# Altium schematic sheet 16.USB_HUB_GL3510.SchDoc
size A3; CheckedBy: YPC; DocumentNumber: 16; Revision: V1.00; SheetNumber: 16; SheetTotal: 18; SheetName: USB_HUB_GL3510; SheetDescribe: USB3.1 Gen1 Hub Controller 原理子图; Designer: JOW; DesignDate: 2025-04-25; CheckedData: 2025-04-25; Rule: PcbType=ProtelPcb
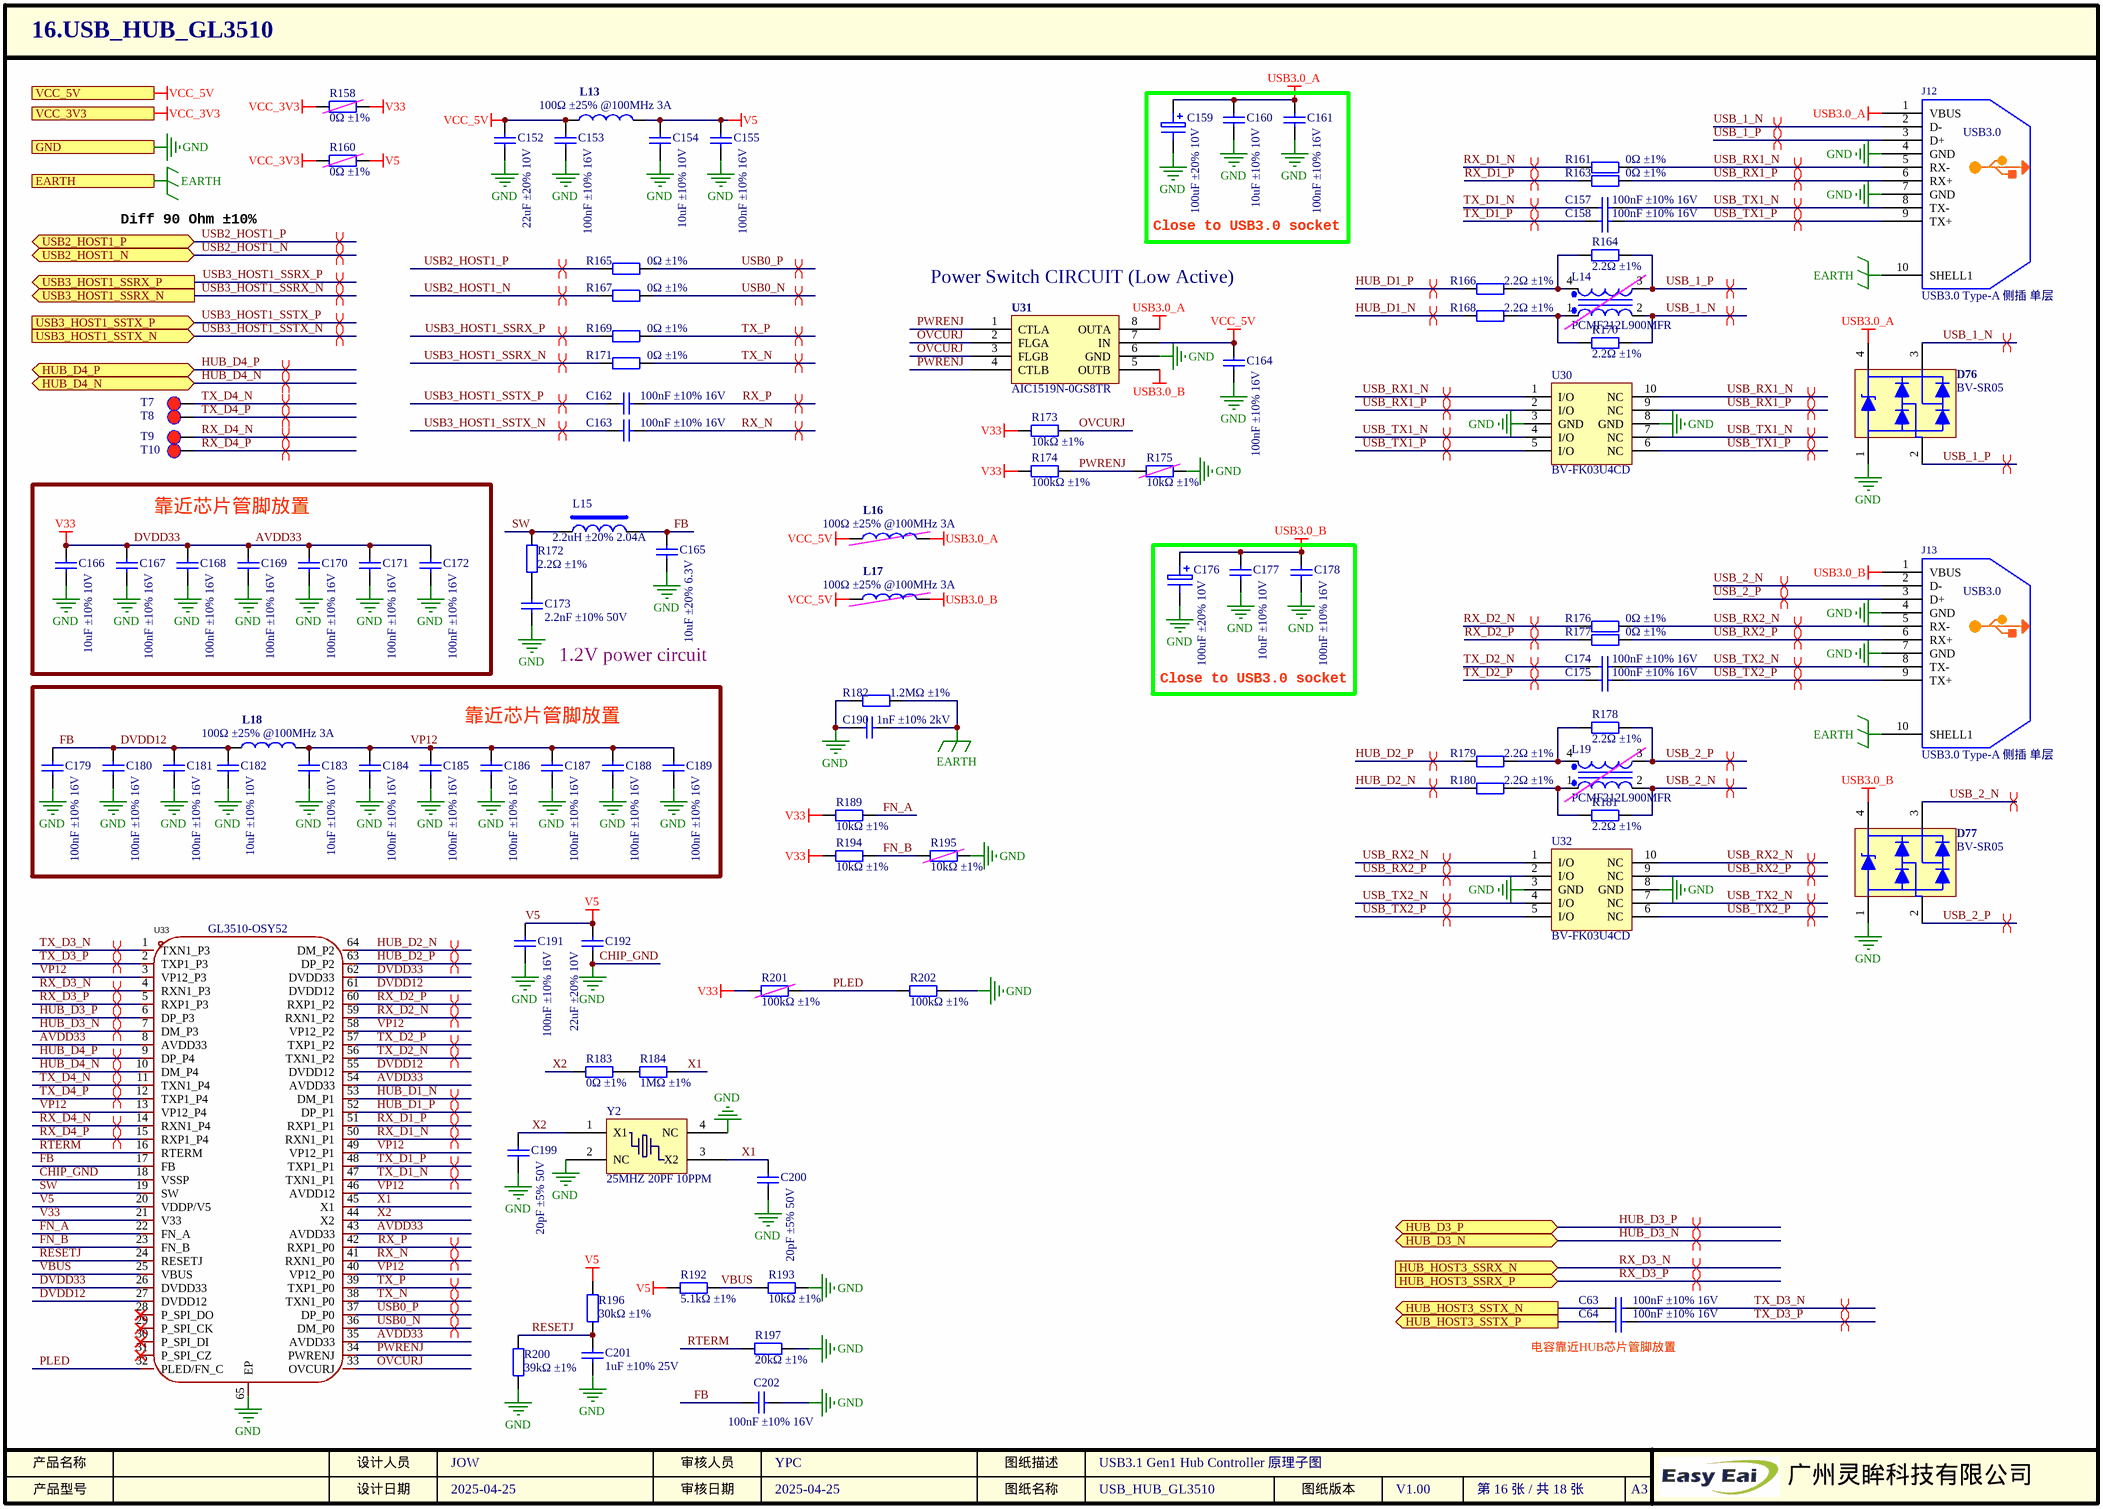
[diagram p0: 16.USB_HUB_GL3510.SchDoc]

## Parts
C63  描述: 100nF ±10% 16V  [0402_C]  (hidden comment: CL05B104KO5NNNC)
C64  描述: 100nF ±10% 16V  [0402_C]  (hidden comment: CL05B104KO5NNNC)
C152  描述: 22uF ±20% 10V  [0603_C]  (hidden comment: CL10A226MP8NUNE)
C153  描述: 100nF ±10% 16V  [0402_C]  (hidden comment: CL05B104KO5NNNC)
C154  描述: 10uF ±10% 10V  [0603_C]  (hidden comment: CL10A106KP8NNNC)
C155  描述: 100nF ±10% 16V  [0402_C]  (hidden comment: CL05B104KO5NNNC)
C157  描述: 100nF ±10% 16V  [0402_C]  (hidden comment: CL05B104KO5NNNC)
C158  描述: 100nF ±10% 16V  [0402_C]  (hidden comment: CL05B104KO5NNNC)
C159  描述: 100uF ±20% 10V  [SMD,D5xL5.4mm]  (hidden comment: RVT1A101M0505)
C160  描述: 10uF ±10% 10V  [0603_C]  (hidden comment: CL10A106KP8NNNC)
C161  描述: 100nF ±10% 16V  [0402_C]  (hidden comment: CL05B104KO5NNNC)
C162  描述: 100nF ±10% 16V  [0402_C]  (hidden comment: CL05B104KO5NNNC)
C163  描述: 100nF ±10% 16V  [0402_C]  (hidden comment: CL05B104KO5NNNC)
C164  描述: 100nF ±10% 16V  [0402_C]  (hidden comment: CL05B104KO5NNNC)
C165  描述: 10uF ±20% 6.3V  [0402_C]  (hidden comment: CL05A106MQ5NUNC)
C166  描述: 10uF ±10% 10V  [0603_C]  (hidden comment: CL10A106KP8NNNC)
C167  描述: 100nF ±10% 16V  [0402_C]  (hidden comment: CL05B104KO5NNNC)
C168  描述: 100nF ±10% 16V  [0402_C]  (hidden comment: CL05B104KO5NNNC)
C169  描述: 100nF ±10% 16V  [0402_C]  (hidden comment: CL05B104KO5NNNC)
C170  描述: 100nF ±10% 16V  [0402_C]  (hidden comment: CL05B104KO5NNNC)
C171  描述: 100nF ±10% 16V  [0402_C]  (hidden comment: CL05B104KO5NNNC)
C172  描述: 100nF ±10% 16V  [0402_C]  (hidden comment: CL05B104KO5NNNC)
C173  描述: 2.2nF ±10% 50V  [0402_C]  (hidden comment: 0402B222K500NT)
C174  描述: 100nF ±10% 16V  [0402_C]  (hidden comment: CL05B104KO5NNNC)
C175  描述: 100nF ±10% 16V  [0402_C]  (hidden comment: CL05B104KO5NNNC)
C176  描述: 100uF ±20% 10V  [SMD,D5xL5.4mm]  (hidden comment: RVT1A101M0505)
C177  描述: 10uF ±10% 10V  [0603_C]  (hidden comment: CL10A106KP8NNNC)
C178  描述: 100nF ±10% 16V  [0402_C]  (hidden comment: CL05B104KO5NNNC)
C179  描述: 100nF ±10% 16V  [0402_C]  (hidden comment: CL05B104KO5NNNC)
C180  描述: 100nF ±10% 16V  [0402_C]  (hidden comment: CL05B104KO5NNNC)
C181  描述: 100nF ±10% 16V  [0402_C]  (hidden comment: CL05B104KO5NNNC)
C182  描述: 10uF ±10% 10V  [0603_C]  (hidden comment: CL10A106KP8NNNC)
C183  描述: 10uF ±10% 10V  [0603_C]  (hidden comment: CL10A106KP8NNNC)
C184  描述: 100nF ±10% 16V  [0402_C]  (hidden comment: CL05B104KO5NNNC)
C185  描述: 100nF ±10% 16V  [0402_C]  (hidden comment: CL05B104KO5NNNC)
C186  描述: 100nF ±10% 16V  [0402_C]  (hidden comment: CL05B104KO5NNNC)
C187  描述: 100nF ±10% 16V  [0402_C]  (hidden comment: CL05B104KO5NNNC)
C188  描述: 100nF ±10% 16V  [0402_C]  (hidden comment: CL05B104KO5NNNC)
C189  描述: 100nF ±10% 16V  [0402_C]  (hidden comment: CL05B104KO5NNNC)
C190  描述: 1nF ±10% 2kV  [1206_C]  (hidden comment: CC1206KKX7RDBB102)
C191  描述: 100nF ±10% 16V  [0402_C]  (hidden comment: CL05B104KO5NNNC)
C192  描述: 22uF ±20% 10V  [0603_C]  (hidden comment: CL10A226MP8NUNE)
C199  描述: 20pF ±5% 50V  [0402_C]  (hidden comment: 0402CG200J500NT)
C200  描述: 20pF ±5% 50V  [0402_C]  (hidden comment: 0402CG200J500NT)
C201  描述: 1uF ±10% 25V  [0402_C]  (hidden comment: CL05A105KA5NQNC)
C202  描述: 100nF ±10% 16V  [0402_C]  (hidden comment: CL05B104KO5NNNC)
D76  BV-SR05  [SOT-143]
D77  BV-SR05  [SOT-143]
J12  U231-091N-4BLCC14-S5  [USB3.0-A-TH_U231-091N-4BLCC14-S-5]  (value not drawn)
J13  U231-091N-4BLCC14-S5  [USB3.0-A-TH_U231-091N-4BLCC14-S-5]  (value not drawn)
L13  MPZ1608S101ATAH0  [0603_R]  (value not drawn)
L14  PCMF212L900MFR  [SMD2012]  (no BOM)
L15  VLS252012HBX-2R2M-1  [IND_252012]  (value not drawn)
L16  MPZ1608S101ATAH0  [0603_R]  (value not drawn)  (no BOM)
L17  MPZ1608S101ATAH0  [0603_R]  (value not drawn)  (no BOM)
L18  MPZ1608S101ATAH0  [0603_R]  (value not drawn)
L19  PCMF212L900MFR  [SMD2012]  (no BOM)
R158  描述: 0Ω ±1%  [0805_R]  (hidden comment: 0805W8F0000T5E)  (no BOM)
R160  描述: 0Ω ±1%  [0805_R]  (hidden comment: 0805W8F0000T5E)  (no BOM)
R161  描述: 0Ω ±1%  [0402_R]  (hidden comment: 0402WGF0000TCE)
R163  描述: 0Ω ±1%  [0402_R]  (hidden comment: 0402WGF0000TCE)
R164  描述: 2.2Ω ±1%  [0402_R]  (hidden comment: 0402WGF220KTCE)
R165  描述: 0Ω ±1%  [0402_R]  (hidden comment: 0402WGF0000TCE)
R166  描述: 2.2Ω ±1%  [0402_R]  (hidden comment: 0402WGF220KTCE)
R167  描述: 0Ω ±1%  [0402_R]  (hidden comment: 0402WGF0000TCE)
R168  描述: 2.2Ω ±1%  [0402_R]  (hidden comment: 0402WGF220KTCE)
R169  描述: 0Ω ±1%  [0402_R]  (hidden comment: 0402WGF0000TCE)
R170  描述: 2.2Ω ±1%  [0402_R]  (hidden comment: 0402WGF220KTCE)
R171  描述: 0Ω ±1%  [0402_R]  (hidden comment: 0402WGF0000TCE)
R172  描述: 2.2Ω ±1%  [0402_R]  (hidden comment: 0402WGF220KTCE)
R173  描述: 10kΩ ±1%  [0402_R]  (hidden comment: 0402WGF1002TCE)
R174  描述: 100kΩ ±1%  [0402_R]  (hidden comment: 0402WGF1003TCE)
R175  描述: 10kΩ ±1%  [0402_R]  (hidden comment: 0402WGF1002TCE)  (no BOM)
R176  描述: 0Ω ±1%  [0402_R]  (hidden comment: 0402WGF0000TCE)
R177  描述: 0Ω ±1%  [0402_R]  (hidden comment: 0402WGF0000TCE)
R178  描述: 2.2Ω ±1%  [0402_R]  (hidden comment: 0402WGF220KTCE)
R179  描述: 2.2Ω ±1%  [0402_R]  (hidden comment: 0402WGF220KTCE)
R180  描述: 2.2Ω ±1%  [0402_R]  (hidden comment: 0402WGF220KTCE)
R181  描述: 2.2Ω ±1%  [0402_R]  (hidden comment: 0402WGF220KTCE)
R182  描述: 1.2MΩ ±1%  [1206_R]  (hidden comment: 1206W4F1204T5E)
R183  描述: 0Ω ±1%  [0402_R]  (hidden comment: 0402WGF0000TCE)
R184  描述: 1MΩ ±1%  [0402_R]  (hidden comment: RC-02W1004FT)
R189  描述: 10kΩ ±1%  [0402_R]  (hidden comment: 0402WGF1002TCE)
R192  描述: 5.1kΩ ±1%  [0402_R]  (hidden comment: 0402WGF5101TCE)
R193  描述: 10kΩ ±1%  [0402_R]  (hidden comment: 0402WGF1002TCE)
R194  描述: 10kΩ ±1%  [0402_R]  (hidden comment: 0402WGF1002TCE)
R195  描述: 10kΩ ±1%  [0402_R]  (hidden comment: 0402WGF1002TCE)  (no BOM)
R196  描述: 30kΩ ±1%  [0402_R]  (hidden comment: NQ02WGF3002TCE)
R197  描述: 20kΩ ±1%  [0402_R]  (hidden comment: 0402WGF2002TCE)
R200  描述: 39kΩ ±1%  [0402_R]  (hidden comment: RC0402FR-0739KL)
R201  描述: 100kΩ ±1%  [0402_R]  (hidden comment: 0402WGF1003TCE)  (no BOM)
R202  描述: 100kΩ ±1%  [0402_R]  (hidden comment: 0402WGF1003TCE)
T7  TEST-DOT  [PAD-25/40]  (value not drawn)  (no BOM)
T8  TEST-DOT  [PAD-25/40]  (value not drawn)  (no BOM)
T9  TEST-DOT  [PAD-25/40]  (value not drawn)  (no BOM)
T10  TEST-DOT  [PAD-25/40]  (value not drawn)  (no BOM)
U30  型号: BV-FK03U4CD  [UDFN-10]  (hidden comment: ESD BV-FK03U4CD)
U31  AIC1519N-0GS8TR  [SOP-8]
U32  型号: BV-FK03U4CD  [UDFN-10]  (hidden comment: ESD BV-FK03U4CD)
U33  GL3510-OSY52  [QFN-64_L8.0-W8.0-P0.40-BL-EP5.4]
Y2  X322525MSB4SI  [SMD-3225_4P]  (value not drawn)

## Blocks framed on the sheet
Close to USB3.0 socket: C159-C161
靠近芯片管脚放置: C166-C172
Close to USB3.0 socket: C176-C178
靠近芯片管脚放置: C179-C189 L18

## Ports
EARTH, GND, HUB_D3_N (bidir), HUB_D3_P (bidir), HUB_D4_N (bidir), HUB_D4_P (bidir), HUB_HOST3_SSRX_N (in), HUB_HOST3_SSRX_P (in), HUB_HOST3_SSTX_N (out), HUB_HOST3_SSTX_P (out), USB2_HOST1_N (bidir), USB2_HOST1_P (bidir), USB3_HOST1_SSRX_N (out), USB3_HOST1_SSRX_P (out), USB3_HOST1_SSTX_N (in), USB3_HOST1_SSTX_P (in), VCC_3V3 (in), VCC_5V (in)

## Nets
AVDD33: C166.1 C167.1 C168.1 C169.1 C170.1 C171.1 C172.1 R158.2 R173.1 R174.1 R189.2 R194.2 R201.1 U33.8(AVDD33) U33.21(V33) U33.26(DVDD33) U33.35(AVDD33) U33.43(AVDD33) U33.54(AVDD33) U33.62(DVDD33)  [also labelled DVDD33, V33]
CHIP_GND: C152.1 C153.2 C154.1 C155.2 C159.2 C160.1 C161.1 C164.1 C165.1 C166.2 C167.2 C168.2 C169.2 C170.2 C171.2 C172.2 C173.1 C176.2 C177.1 C178.1 C179.2 C180.2 C181.2 C182.2 C183.2 C184.2 C185.2 C186.2 C187.2 C188.2 C189.2 C190.1 C191.2 C192.1 C199.1 C200.1 C201.1 C202.1 D76.1 D77.1 J12.4(GND) J12.7(GND) J13.4(GND) J13.7(GND) R175.1 R182.1 R193.1 R195.1 R197.2 R200.1 R202.2 U30.3(GND) U30.8(GND) U31.6(GND) U32.3(GND) U32.8(GND) U33.18(VSSP) U33.65(EP) Y2.2(NC) Y2.4(NC) ; port GND  [also labelled GND]
EARTH: C190.2 J12.10(SHELL1) J13.10(SHELL1) R182.2 ; port EARTH
USB3.0_A: C159.1 C160.2 C161.2 D76.4 J12.1(VBUS) L16.2 U31.8(OUTA)
USB3.0_B: C176.1 C177.2 C178.2 D77.4 J13.1(VBUS) L17.2 U31.5(OUTB)
V5: C154.2 C155.1 C191.1 C192.2 L13.2 R160.2 R192.1 R196.2 U33.20(VDDP/V5)
VCC_3V3: R158.1 R160.1 ; port VCC_3V3
VCC_5V: C152.2 C153.1 C164.2 L13.1 L16.1 L17.1 U31.7(IN) ; port VCC_5V
DVDD12: C165.2 C179.1 C180.1 C181.1 C182.1 C202.2 L15.2 L18.1 U33.17(FB) U33.27(DVDD12) U33.55(DVDD12) U33.61(DVDD12)  [also labelled FB]
FN_A: R189.1 U33.22(FN_A)
FN_B: R194.1 R195.2 U33.23(FN_B)
HUB_D1_N: R168.1 U33.53(DM_P1)
HUB_D1_P: R166.1 U33.52(DP_P1)
HUB_D2_N: R180.1 U33.64(DM_P2)
HUB_D2_P: R179.1 U33.63(DP_P2)
HUB_D3_N: U33.7(DM_P3) ; port HUB_D3_N
HUB_D3_P: U33.6(DP_P3) ; port HUB_D3_P
HUB_D4_N: U33.10(DM_P4) ; port HUB_D4_N
HUB_D4_P: U33.9(DP_P4) ; port HUB_D4_P
HUB_HOST3_SSTX_N: C63.2 ; port HUB_HOST3_SSTX_N
HUB_HOST3_SSTX_P: C64.2 ; port HUB_HOST3_SSTX_P
OVCURJ: R173.2 U31.2(FLGA) U31.3(FLGB) U33.33(OVCURJ)
PLED: R201.2 R202.1 U33.32(PLED/FN_C)
PWRENJ: R174.2 R175.2 U31.1(CTLA) U31.4(CTLB) U33.34(PWRENJ)
RESETJ: C201.2 R196.1 R200.2 U33.24(RESETJ)
RTERM: R197.1 U33.16(RTERM)
RX_D1_N: R161.1 U33.50(RXN1_P1)
RX_D1_P: R163.1 U33.51(RXP1_P1)
RX_D2_N: R176.1 U33.59(RXN1_P2)
RX_D2_P: R177.1 U33.60(RXP1_P2)
RX_D3_N: U33.4(RXN1_P3) ; port HUB_HOST3_SSRX_N
RX_D3_P: U33.5(RXP1_P3) ; port HUB_HOST3_SSRX_P
RX_D4_N: T9.1 U33.14(RXN1_P4)
RX_D4_P: T10.1 U33.15(RXP1_P4)
RX_N: C163.1 U33.41(RXN1_P0)
RX_P: C162.1 U33.42(RXP1_P0)
SW: L15.1 R172.2 U33.19(SW)
TX_D1_N: C157.1 U33.47(TXN1_P1)
TX_D1_P: C158.1 U33.48(TXP1_P1)
TX_D2_N: C174.1 U33.56(TXN1_P2)
TX_D2_P: C175.1 U33.57(TXP1_P2)
TX_D3_N: C63.1 U33.1(TXN1_P3)
TX_D3_P: C64.1 U33.2(TXP1_P3)
TX_D4_N: T7.1 U33.11(TXN1_P4)
TX_D4_P: T8.1 U33.12(TXP1_P4)
TX_N: R171.2 U33.38(TXN1_P0)
TX_P: R169.2 U33.39(TXP1_P0)
USB0_N: R167.2 U33.36(DM_P0)
USB0_P: R165.2 U33.37(DP_P0)
USB2_HOST1_N: R167.1 ; port USB2_HOST1_N
USB2_HOST1_P: R165.1 ; port USB2_HOST1_P
USB3_HOST1_SSRX_N: R171.1 ; port USB3_HOST1_SSRX_N
USB3_HOST1_SSRX_P: R169.1 ; port USB3_HOST1_SSRX_P
USB3_HOST1_SSTX_N: C163.2 ; port USB3_HOST1_SSTX_N
USB3_HOST1_SSTX_P: C162.2 ; port USB3_HOST1_SSTX_P
USB_1_N: D76.3 J12.2(D-) L14.2 R170.2
USB_1_P: D76.2 J12.3(D+) L14.3 R164.2
USB_2_N: D77.3 J13.2(D-) L19.2 R181.2
USB_2_P: D77.2 J13.3(D+) L19.3 R178.2
USB_RX1_N: J12.5(RX-) R161.2 U30.1(I/O) U30.10(NC)
USB_RX1_P: J12.6(RX+) R163.2 U30.2(I/O) U30.9(NC)
USB_RX2_N: J13.5(RX-) R176.2 U32.1(I/O) U32.10(NC)
USB_RX2_P: J13.6(RX+) R177.2 U32.2(I/O) U32.9(NC)
USB_TX1_N: C157.2 J12.8(TX-) U30.4(I/O) U30.7(NC)
USB_TX1_P: C158.2 J12.9(TX+) U30.5(I/O) U30.6(NC)
USB_TX2_N: C174.2 J13.8(TX-) U32.4(I/O) U32.7(NC)
USB_TX2_P: C175.2 J13.9(TX+) U32.5(I/O) U32.6(NC)
VBUS: R192.2 R193.2 U33.25(VBUS)
VP12: C183.1 C184.1 C185.1 C186.1 C187.1 C188.1 C189.1 L18.2 U33.3(VP12_P3) U33.13(VP12_P4) U33.40(VP12_P0) U33.46(AVDD12) U33.49(VP12_P1) U33.58(VP12_P2)
X1: C200.2 R184.2 U33.45(X1) Y2.3(X2)
X2: C199.2 R183.1 U33.44(X2) Y2.1(X1)
NetC173_2: C173.2 R172.1
NetL14_1: L14.1 R168.2 R170.1
NetL14_4: L14.4 R164.1 R166.2
NetL19_1: L19.1 R180.2 R181.1
NetL19_4: L19.4 R178.1 R179.2
NetR183_2: R183.2 R184.1

Not connected (* = marked no-connect by the designer): U33 28(P_SPI_DO)* 29(P_SPI_CK)* 30(P_SPI_DI)* 31(P_SPI_CZ)*

## Layout directives
differential pair: HUB_D1_N, HUB_D1_P, HUB_D2_N, HUB_D2_P, HUB_D3_N, HUB_D3_P, HUB_D4_N, HUB_D4_P, RX_D1_N, RX_D1_P, RX_D2_N, RX_D2_P, RX_D3_N, RX_D3_P, RX_D4_N, RX_D4_P, RX_N, RX_P, TX_D1_N, TX_D1_P, TX_D2_N, TX_D2_P, TX_D3_N, TX_D3_P, TX_D4_N, TX_D4_P, TX_N, TX_P, USB0_N, USB0_P, USB2_HOST1_N, USB2_HOST1_P, USB3_HOST1_SSRX_N, USB3_HOST1_SSRX_P, USB3_HOST1_SSTX_N, USB3_HOST1_SSTX_P, USB_1_N, USB_1_P, USB_2_N, USB_2_P, USB_RX1_N, USB_RX1_P, USB_RX2_N, USB_RX2_P, USB_TX1_N, USB_TX1_P, USB_TX2_N, USB_TX2_P

## Notes on the sheet
- Diff 90 Ohm ±10%
- (near U31) Power Switch CIRCUIT (Low Active)
- (near C173) 1.2V power circuit
- 电容靠近HUB芯片管脚放置
- 产品名称
- 产品型号
- 设计人员
- 设计日期
- 审核人员
- 审核日期
- 图纸名称
- 图纸描述
- 图纸版本
- A3
- 广州灵眸科技有限公司
- (in symbol USB3.0 Type-A 侧插 单层) USB3.0

## Library data of the parts
C63 C64 C153 C155 C157 C158 C161-C164 C167-C172 C174 C175 C178-C181 C184-C189 C191 C202 = 0402 100nF ±10% 16V: SPZL000259; 名称: 贴片电容; 厂商: SAMSUNG(三星); 封装: 0402; 工作温度: -55~125℃; 贴片和直插: SMD; 型号: CL05B104KO5NNNC; SuppliersPartNumber: C1525; 商品编号: SPZL000259
C152 C192 = 0603 22uF ±20% 10V: SPZL000315; 名称: 贴片电容; 厂商: SAMSUNG(三星); 封装: 0603; 工作温度: -55~85℃; 贴片和直插: SMD; 型号: CL10A226MP8NUNE; SuppliersPartNumber: C86295; 商品编号: SPZL000315
C154 C160 C166 C177 C182 C183 = 0603 10uF ±10% 10V: SPZL000260; 名称: 贴片电容; 厂商: SAMSUNG(三星); 封装: 0603; 工作温度: -55~85℃; 贴片和直插: SMD; 型号: CL10A106KP8NNNC; SuppliersPartNumber: C19702; 商品编号: SPZL000260
C159 C176 = 电解电容 100uF ±20% 10V: SPZL000265; 名称: 电解电容; 厂商: ROQANG(容强); 贴片和直插: SMD; 工作温度: -55~105℃; SuppliersPartNumber: C72473; 封装: SMD,D5xL5.4mm; 型号: RVT1A101M0505; 商品编号: SPZL000265
C165 = 0402 10uF ±20% 6.3V: SPZL000269; 名称: 贴片电容; 厂商: SAMSUNG(三星); 封装: 0402; 工作温度: -55~85℃; 贴片和直插: SMD; 型号: CL05A106MQ5NUNC; SuppliersPartNumber: C15525; 商品编号: SPZL000269
C173 = 0402 2.2nF ±10% 50V: SPZL000399; 名称: 贴片电容; 厂商: FH(风华); 封装: 0402; 工作温度: -55~125℃; 贴片和直插: SMD; 型号: 0402B222K500NT; SuppliersPartNumber: C1531; 商品编号: SPZL000399
C190 = 1206 1nF ±10% 2kV: SPZL000332; 名称: 贴片电容; 厂商: YAGEO(国巨); 封装: 1206; 工作温度: -55~125℃; 贴片和直插: SMD; 型号: CC1206KKX7RDBB102; SuppliersPartNumber: C23631; 商品编号: SPZL000332
C199 C200 = 0402 20pF ±5% 50V: SPZL000398; 名称: 贴片电容; 厂商: FH(风华); 封装: 0402; 工作温度: -55~125℃; 贴片和直插: SMD; 型号: 0402CG200J500NT; SuppliersPartNumber: C1554; 商品编号: SPZL000398
C201 = 0402 1uF ±10% 25V: SPZL000337; 名称: 贴片电容; 厂商: SAMSUNG(三星); 封装: 0402; 工作温度: -55~85℃; 贴片和直插: SMD; 型号: CL05A105KA5NQNC; SuppliersPartNumber: C52923; 商品编号: SPZL000337
D76 D77 = TVS BV-SR05: SPZL000616; 名称: TVS; 厂商: Bencent(槟城); 贴片和直插: SMD; 描述: Vdrm=5V Cj=0.85pF; 工作温度: -40~125℃; 封装: SOT-143; SuppliersPartNumber: C413946; 商品编号: SPZL000616; 型号: BV-SR05
J12 J13 = USB3.0 Type-A 侧插 单层: SPZL001065; 名称: USB连接器; 封装: THT; 厂商: XKB Connectivity(中国星坤); 工作温度: -55~85℃; 贴片和直插: THT; SuppliersPartNumber: C388644; 型号: U231-091N-4BLCC14-S5; 商品编号: SPZL001065; 描述: USB3.0 Type-A 侧插 单层
L13 L16-L18 = 100Ω ±25% @100MHz 3A: SPZL000753; 名称: 磁珠; 封装: 0603; 厂商: TDK; 贴片和直插: SMD; 工作温度: -40~85℃; SuppliersPartNumber: C107332; 型号: MPZ1608S101ATAH0; 商品编号: SPZL000753; 描述: 100Ω ±25% @100MHz 3A
L14 L19 = 共模电感 PCMF212L900MFR: SPZL001149; 名称: 共模电感; 厂商: 玛珂斯科技; 贴片和直插: SMD; 描述: 90Ω @100MHz 400mA; 工作温度: -40~85℃; 封装: SMD2012; 商品编号: SPZL001149; 型号: PCMF212L900MFR
L15 = 2.2uH ±20% 2.04A: SPZL000205; 名称: 电感; 厂商: TDK; 封装: 1008; 贴片和直插: SMD; 工作温度: -40~105℃; 型号: VLS252012HBX-2R2M-1; SuppliersPartNumber: C88535; 商品编号: SPZL000205; 描述: 2.2uH ±20% 2.04A
R158 R160 = 0805 0Ω ±1%: SPZL000350; 封装: 0805; 厂商: UNI-ROYAL(厚声); 名称: 电阻; 贴片和直插: SMD; 工作温度: -55~155℃; SuppliersPartNumber: C17477; 型号: 0805W8F0000T5E; 商品编号: SPZL000350
R161 R163 R165 R167 R169 R171 R176 R177 R183 = 0402 0Ω ±1%: SPZL000276; 封装: 0402; 厂商: UNI-ROYAL(厚声); 贴片和直插: SMD; 名称: 电阻; 工作温度: -55~125℃; SuppliersPartNumber: C17168; 型号: 0402WGF0000TCE; 商品编号: SPZL000276
R164 R166 R168 R170 R172 R178-R181 = 0402 2.2Ω ±1%: SPZL000327; 封装: 0402; 厂商: UNI-ROYAL(厚声); 贴片和直插: SMD; 名称: 电阻; 工作温度: -55~155℃; SuppliersPartNumber: C25101; 型号: 0402WGF220KTCE; 商品编号: SPZL000327
R173 R175 R189 R193-R195 = 0402 10kΩ ±1%: SPZL000271; 封装: 0402; 厂商: UNI-ROYAL(厚声); 贴片和直插: SMD; 名称: 电阻; 工作温度: -55~155℃; SuppliersPartNumber: C25744; 型号: 0402WGF1002TCE; 商品编号: SPZL000271
R174 R201 R202 = 0402 100kΩ ±1%: SPZL000282; 封装: 0402; 厂商: UNI-ROYAL(厚声); 贴片和直插: SMD; 名称: 电阻; 工作温度: -55~155℃; SuppliersPartNumber: C25741; 型号: 0402WGF1003TCE; 商品编号: SPZL000282
R182 = 1206 1.2MΩ ±1%: SPZL000388; 封装: 1206; 厂商: UNI-ROYAL(厚声); 名称: 电阻; 贴片和直插: SMD; 工作温度: -55~155℃; SuppliersPartNumber: C22107; 型号: 1206W4F1204T5E; 商品编号: SPZL000388
R184 = 0402 1MΩ ±1%: SPZL000301; 封装: 0402; 厂商: FH(风华); 贴片和直插: SMD; 名称: 电阻; 工作温度: -55~125℃; SuppliersPartNumber: C310185; 型号: RC-02W1004FT; 商品编号: SPZL000301
R192 = 0402 5.1kΩ ±1%: SPZL000270; 封装: 0402; 厂商: UNI-ROYAL(厚声); 贴片和直插: SMD; 名称: 电阻; 工作温度: -55~155℃; SuppliersPartNumber: C25905; 型号: 0402WGF5101TCE; 商品编号: SPZL000270
R196 = 0402 30kΩ ±1%: SPZL000323; 封装: 0402; 厂商: UNI-ROYAL(厚声); 贴片和直插: SMD; 名称: 电阻; 工作温度: -55~155℃; SuppliersPartNumber: C965267; 型号: NQ02WGF3002TCE; 商品编号: SPZL000323
R197 = 0402 20kΩ ±1%: SPZL000349; 封装: 0402; 厂商: UNI-ROYAL(厚声); 贴片和直插: SMD; 名称: 电阻; 工作温度: -55~155℃; SuppliersPartNumber: C25765; 型号: 0402WGF2002TCE; 商品编号: SPZL000349
R200 = 0402 39kΩ ±1%: SPZL001271; 封装: 0402; 厂商: YAGEO(国巨); 贴片和直插: SMD; 名称: 电阻; 工作温度: -55~155℃; SuppliersPartNumber: C137995; 型号: RC0402FR-0739KL; 商品编号: SPZL001271
U30 U32 = ESD BV-FK03U4CD: SPZL000610; 厂商: Bencent(槟城); 贴片和直插: SMD; 描述: Vdrm=3.3V Cj=0.65pF; 工作温度: -40~125℃; 名称: ESD; 封装: UDFN-10; 商品编号: SPZL000610
U31 = AIC1519N-0GS8TR: SPZL001272; 名称: IC; 厂商: AIC(沛亨半导体); 贴片和直插: SMD; 描述: 双USB电源开关; 工作温度: -40℃~+85℃; 封装: SOP-8; SuppliersPartNumber: C211637; 商品编号: SPZL001272; 型号: AIC1519N-0GS8TR
U33 = GL3510-OSY52: SPZL001270; 名称: IC; 描述: USB3.1Gen1 Hub芯片; 厂商: GENESYS(创惟); 工作温度: 0~70℃; 封装: QFN64; 贴片和直插: SMD; 型号: GL3510-OSY52; 商品编号: SPZL001270; SuppliersPartNumber: C7501408
Y2 = 25MHZ 20PF 10PPM: SPZL000475; 封装: SMD3225-4P; 厂商: YXC扬兴科技; 贴片和直插: SMD; 名称: 无源晶振; 工作温度: -40~85℃; SuppliersPartNumber: C13740; 型号: X322525MSB4SI; 商品编号: SPZL000475; 描述: 25MHZ 20PF 10PPM